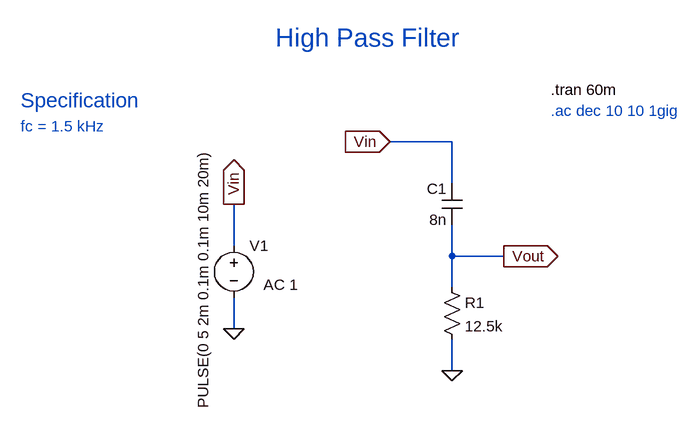
[diagram p0: schematic HighPassFilter.asc]
HighPassFilter.asc, the LTspice schematic file:
Version 4
SHEET 1 880 680
WIRE 240 96 144 96
WIRE 240 160 240 96
WIRE -96 256 -96 192
WIRE 240 272 240 224
WIRE 320 272 240 272
WIRE 240 320 240 272
WIRE -96 384 -96 336
WIRE 240 448 240 400
FLAG 240 448 0
FLAG 144 96 Vin
IOPIN 144 96 In
FLAG 320 272 Vout
IOPIN 320 272 Out
FLAG -96 384 0
FLAG -96 192 Vin
IOPIN -96 192 Out
SYMBOL res 224 304 R0
SYMATTR InstName R1
SYMATTR Value 12.5k
SYMBOL cap 256 224 R180
WINDOW 0 24 56 Left 2
WINDOW 3 24 8 Left 2
SYMATTR InstName C1
SYMATTR Value 8n
SYMBOL voltage -96 240 R0
WINDOW 123 46 76 Left 2
WINDOW 39 0 0 Left 0
WINDOW 3 -47 -132 VRight 2
SYMATTR Value2 AC 1
SYMATTR Value PULSE(0 5 2m 0.1m 0.1m 10m 20m)
SYMATTR InstName V1
TEXT 392 16 Left 2 !.tran 60m
TEXT 392 48 Left 2 ;.ac dec 10 10 1gig
TEXT -32 -64 Left 4 ;High Pass Filter
TEXT -424 32 Left 3 ;Specification
TEXT -424 72 Left 2 ;fc = 1.5 kHz

The netlist it stands for:
* HighPassFilter.asc
R1 Vout 0 12.5k
C1 Vout Vin 8n
V1 Vin 0 PULSE(0 5 2m 0.1m 0.1m 10m 20m) AC 1
.tran 60m
* .ac dec 10 10 1gig
* High Pass Filter
* Specification
* fc = 1.5 kHz
.backanno
.end